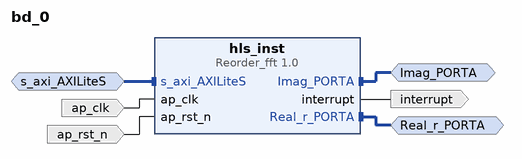
[diagram p0: block diagram of the top level]
# Vivado block design bd_0, xc7z010clg400-1, Vivado 2019.1.3
create_bd_design bd_0

create_bd_intf_port -mode Master -vlnv xilinx.com:interface:bram_rtl:1.0 Imag_PORTA
set_property -dict {CONFIG.MASTER_TYPE BRAM_CTRL} [get_bd_intf_ports Imag_PORTA]
create_bd_intf_port -mode Master -vlnv xilinx.com:interface:bram_rtl:1.0 Real_r_PORTA
set_property -dict {CONFIG.MASTER_TYPE BRAM_CTRL} [get_bd_intf_ports Real_r_PORTA]
create_bd_intf_port -mode Slave -vlnv xilinx.com:interface:aximm_rtl:1.0 s_axi_AXILiteS
set_property -dict [list \
  CONFIG.ADDR_WIDTH 12 \
  CONFIG.ARUSER_WIDTH 0 \
  CONFIG.AWUSER_WIDTH 0 \
  CONFIG.BUSER_WIDTH 0 \
  CONFIG.DATA_WIDTH 32 \
  CONFIG.FREQ_HZ 100000000.0 \
  CONFIG.HAS_BRESP 1 \
  CONFIG.HAS_BURST 0 \
  CONFIG.HAS_CACHE 0 \
  CONFIG.HAS_LOCK 0 \
  CONFIG.HAS_PROT 0 \
  CONFIG.HAS_QOS 0 \
  CONFIG.HAS_REGION 0 \
  CONFIG.HAS_RRESP 1 \
  CONFIG.HAS_WSTRB 1 \
  CONFIG.ID_WIDTH 0 \
  CONFIG.MAX_BURST_LENGTH 1 \
  CONFIG.NUM_READ_OUTSTANDING 1 \
  CONFIG.NUM_READ_THREADS 1 \
  CONFIG.NUM_WRITE_OUTSTANDING 1 \
  CONFIG.NUM_WRITE_THREADS 1 \
  CONFIG.PROTOCOL AXI4LITE \
  CONFIG.READ_WRITE_MODE READ_WRITE \
  CONFIG.RUSER_BITS_PER_BYTE 0 \
  CONFIG.RUSER_WIDTH 0 \
  CONFIG.SUPPORTS_NARROW_BURST 0 \
  CONFIG.WUSER_BITS_PER_BYTE 0 \
  CONFIG.WUSER_WIDTH 0 \
] [get_bd_intf_ports s_axi_AXILiteS]
create_bd_port -dir I -type clk ap_clk
set_property -dict {CONFIG.FREQ_HZ 100000000.0} [get_bd_ports ap_clk]
create_bd_port -dir I -type rst ap_rst_n
create_bd_port -dir O -type intr interrupt

create_bd_cell -type ip -vlnv xilinx.com:hls:Reorder_fft:1.0 hls_inst

# ---- connections ----

connect_bd_intf_net [get_bd_intf_ports Imag_PORTA] [get_bd_intf_pins hls_inst/Imag_PORTA]
connect_bd_intf_net [get_bd_intf_ports Real_r_PORTA] [get_bd_intf_pins hls_inst/Real_r_PORTA]
connect_bd_intf_net -intf_net s_axi_AXILiteS_0_1 [get_bd_intf_ports s_axi_AXILiteS] [get_bd_intf_pins hls_inst/s_axi_AXILiteS]
connect_bd_net -net ap_clk_0_1 [get_bd_ports ap_clk] [get_bd_pins hls_inst/ap_clk]
connect_bd_net -net ap_rst_n_0_1 [get_bd_ports ap_rst_n] [get_bd_pins hls_inst/ap_rst_n]
connect_bd_net [get_bd_pins hls_inst/interrupt] [get_bd_ports interrupt]

# ---- address map ----
assign_bd_address -offset 0x000 -range 4K -target_address_space [get_bd_addr_spaces s_axi_AXILiteS] [get_bd_addr_segs hls_inst/s_axi_AXILiteS/Reg]

validate_bd_design
save_bd_design
